# Altium schematic sheet host_connector.SchDoc: WULPUS PRO
size A4; DrawnBy: Sergei Vostrikov; Organization: Integrated Systems Laboratory; Revision: 1.0.0; SheetNumber: 8; SheetTotal: 8
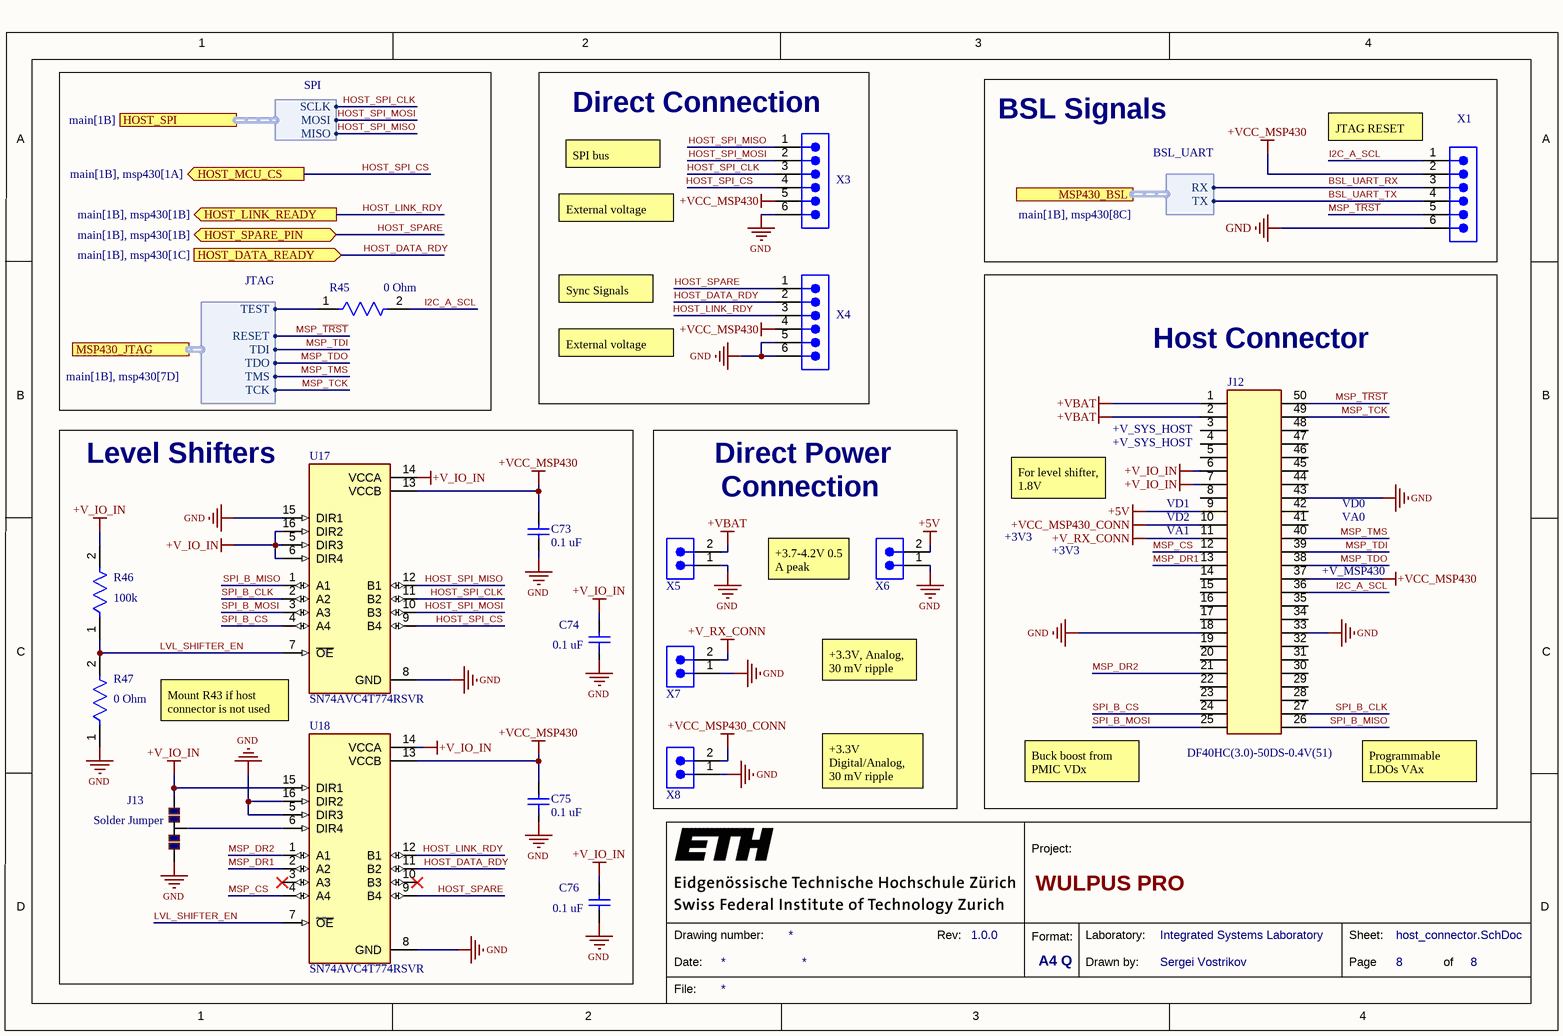
[diagram p0: host_connector.SchDoc]

## Parts
C73  0.1 uF  [CAPC1005X55X30LL05T10]
C74  0.1 uF  [CAPC1005X55X30LL05T10]
C75  0.1 uF  [CAPC1005X55X30LL05T10]
C76  0.1 uF  [CAPC1005X55X30LL05T10]
J12  DF40HC(3.0)-50DS-0.4V(51)  [DF40HC3050DS04V51]
J13  Solder Jumper  [Jumper 3 pins]  (no BOM)
R45  0 Ohm  [FP-CRCW0402-e3-IPC_C]
R46  100k  [FP-ERJ2RK-IPC_C]
R47  0 Ohm  [FP-CRCW0402-e3-IPC_C]
U17  SN74AVC4T774RSVR  [QFN40P260X180X55-16N]
U18  SN74AVC4T774RSVR  [QFN40P260X180X55-16N]
X1  68000-106HLF  [68000-106HLF]  (value not drawn)
X3  68000-106HLF  [68000-106HLF]  (value not drawn)
X4  68000-106HLF  [68000-106HLF]  (value not drawn)
X5  68000-102HLF  [68000-102HLF]  (value not drawn)
X6  68000-102HLF  [68000-102HLF]  (value not drawn)
X7  68000-102HLF  [68000-102HLF]  (value not drawn)
X8  68000-102HLF  [68000-102HLF]  (value not drawn)

## Blocks framed on the sheet
Direct Connection: X3 X4
BSL Signals: X1
Host Connector: J12
Level Shifters: C73-C76 J13 R46 R47 U17 U18

## Ports
HOST_DATA_READY (in, see main[1B], msp430[1C]), HOST_LINK_READY (out, see main[1B], msp430[1B]), HOST_MCU_CS (out, see main[1B], msp430[1A]), HOST_SPARE_PIN (bidir, see main[1B], msp430[1B]), HOST_SPI (harness SPI, see main[1B]), MSP430_BSL (harness BSL_UART, see main[1B], msp430[8C]), MSP430_JTAG (harness JTAG, see main[1B], msp430[7D])

## Harnesses
SPI: SCLK, MOSI, MISO
JTAG: TEST, RESET, TDI, TDO, TMS, TCK
BSL_UART: TX, RX

## Nets
+5V: J12.9 X6.2
+V_IO_IN: C74.1 C76.1 J12.6 J12.7 J13.3 R46.2 U17.5(DIR3) U17.6(DIR4) U17.14(VCCA) U17.16(DIR2) U18.14(VCCA) U18.15(DIR1)
+V_RX_CONN: J12.11 X7.2
+VBAT: J12.1 J12.2 X5.2
+VCC_MSP430: C73.1 C75.1 J12.37 U17.13(VCCB) U18.13(VCCB) X1.2 X3.5 X4.4
+VCC_MSP430_CONN: J12.10 X8.2
GND: C73.2 C74.2 C75.2 C76.2 J12.18 J12.33 J12.43 J13.1 R47.1 U17.8(GND) U17.15(DIR1) U18.5(DIR3) U18.8(GND) U18.16(DIR2) X1.6 X3.6 X4.5 X4.6 X5.1 X6.1 X7.1 X8.1
BSL_UART_RX: X1.3 ; port MSP430_BSL.RX
BSL_UART_TX: X1.4 ; port MSP430_BSL.TX
HOST_DATA_RDY: U18.11(B2) X4.2 ; port HOST_DATA_READY
HOST_LINK_RDY: U18.12(B1) X4.3 ; port HOST_LINK_READY
HOST_SPARE: U18.9(B4) X4.1 ; port HOST_SPARE_PIN
HOST_SPI_CLK: U17.11(B2) X3.3 ; port HOST_SPI.SCLK
HOST_SPI_CS: U17.9(B4) X3.4 ; port HOST_MCU_CS
HOST_SPI_MISO: U17.12(B1) X3.1 ; port HOST_SPI.MISO
HOST_SPI_MOSI: U17.10(B3) X3.2 ; port HOST_SPI.MOSI
I2C_A_SCL: J12.36 R45.2 X1.1
LVL_SHIFTER_EN: R46.1 R47.2 U17.7(~{OE}) U18.7(~{OE})
MSP_CS: J12.12 U18.4(A4)
MSP_DR1: J12.13 U18.2(A2)
MSP_DR2: J12.21 U18.1(A1)
MSP_~{TRST}: J12.50 X1.5 ; port MSP430_JTAG.RESET
MSP_TCK: J12.49 ; port MSP430_JTAG.TCK
MSP_TDI: J12.39 ; port MSP430_JTAG.TDI
MSP_TDO: J12.38 ; port MSP430_JTAG.TDO
MSP_TMS: J12.40 ; port MSP430_JTAG.TMS
SPI_B_CLK: J12.27 U17.2(A2)
SPI_B_CS: J12.24 U17.4(A4)
SPI_B_MISO: J12.26 U17.1(A1)
SPI_B_MOSI: J12.25 U17.3(A3)
NetJ13_2: J13.2 U18.6(DIR4)
NetR45_1: R45.1 ; port MSP430_JTAG.TEST

Not connected (* = marked no-connect by the designer): J12 3 4 5 8 14 15 16 17 19 20 22 23 28 29 30 31 32 34 35 41 42 44 45 46 47 48; U18 3(A3)* 10(B3)*

## Notes on the sheet
- SPI bus
- (near X1) JTAG RESET
- External voltage level
- Sync Signals
- (near J12) +V_SYS_HOST
- Direct Power
- Connection
- For level shifter, 1.8V
- (near J12) VD1
- (near J12) VD2
- VD0
- VA0
- +3.7-4.2V 0.5 A peak
- +3V3
- (near J12) VA1
- (near J12) +V_MSP430
- Mount R43 if host connector is not used
- +3.3V, Analog, 30 mV ripple
- +3.3V Digital/Analog, 30 mV ripple
- Buck boost from PMIC VDx
- Programmable LDOs VAx
- 1
- 2
- 3
- 4
- A
- B
- C
- Project:
- D
- Date:
- Drawing number:
- Rev:
- Format:
- A4 Q
- Drawn by:
- Laboratory:
- Page
- Sheet:
- of
- File:

## Library data of the parts
C73-C76 = CMP-0001-00074-2: C0402C104K4RACTU; Manufacturer: Kemet; Part Number: C0402C104K4RACTU
J12 = DF40HC(3.0)-50DS-0.4V(51): 50 Position 0.4mm Pitch Dual Row Vertical Surface Mount (SMT) Pin Socket, 3.0mm Stacking Height; Mfr_Name: Hirose; Copyright: Copyright (C) 2023 Ultra Librarian. All rights reserved.; Manufacturer_Part_Number: DF40HC(3.0)-50DS-0.4V(51); RefDes: RefDes; Type: DEV
J13 = CMP-00467-6: Solder Jumper 3 Pads; Technology: SMT
R45 R47 = CMP-2002-08122-2: CRCW04020000Z0ED; Tolerance: 5%; Max Power Dissipation: 63mW; Voltage Rating: 50V; Temperature Coefficient: 100ppm/°C; Resistance: 0mR; Contact Plating: Tin; Height: 0.35mm; Radiation Hardening: No; Features: Automotive AEC-Q200; Composition: Thick Film; Width: 0.5mm; Weight: 2.3E-05oz; Termination: SMD/SMT; Packaging: Tape and Reel; Mount: Surface Mount; Case Code (Metric): 1005; Military Standard: Not; Min Operating Temperature: -55°C; Number of Terminations: 2; Package Quantity: 1; Case Code (Imperial): 0402; Depth: 0.5mm; Max Operating Temperature: 155°C; Case/Package: 0402; Power Rating: 63mW; Lead Free: Lead Free; Voltage Rating (DC): 50V; Length: 1mm
R46 = CMP-2002-00608-4: ERJ-2RKF1003X; Resistance: 100kR; Voltage Rating (DC): 50V; Tolerance: 1%; Power Rating: 100mW; Temperature Coefficient: 100ppm/°C; Case/Package: 0402; Length: 1mm; Package Quantity: 1; Radiation Hardening: No; Case Code (Metric): 1005; Contact Plating: Tin; Mount: Surface Mount; Depth: 0.5mm; Max Operating Temperature: 155°C; Lead Free: Lead Free; Width: 0.5mm; Composition: Thick Film; Case Code (Imperial): 0402; Termination: SMD/SMT; Number of Pins: 2; Height: 0.35mm; Voltage Rating: 50V; Military Standard: Not; REACH SVHC: No SVHC; Packaging: Tape and Reel; Min Operating Temperature: -55°C; Max Power Dissipation: 100mW; Features: Automotive AEC-Q200; Number of Terminations: 2
U17 U18 = SN74AVC4T774RSVR: Voltage Level Translator Bidirectional 1 Circuit 4 Channel 380Mbps 16-UQFN _2.6x1.8_; MF: Texas Instruments; MP: SN74AVC4T774RSVR; DigiKey-Purchase-URL: https://snapeda.com/shop?store=DigiKey&id=192411; SnapEDA_Link: https://www.snapeda.com/parts/SN74AVC4T774RSVR/Texas%20Instruments/view-part/192411/?ref=snap; Digi-Key_Part_Number: 296-24741-1-ND; Package: UQFN-16 Texas Instruments; Value: *
X1 X3 X4 = CMP-00729-1: 6 Positions Header, Unshrouded Connector 0.100" (2.54mm) Through Hole Gold or Gold, GXT™; Current Rating: 3A; Voltage Rating: 1.5kV; Number of Positions: 6; Insulation Resistance: 5GR; Gender: Male; Connector Type: Male Pin; Mating Post Length: 5.84mm; Mount: Through Hole; Contact Plating: Nickel, Gold, GXT; Contact Material: Bronze; Colour: Black; Housing Colour: Black; Housing Material: Thermoplastic; Min Operating Temperature: -65°C; Max Operating Temperature: 125°C; Contact Gender: Male; Package Quantity: 100; Number of Rows: 1; Packaging: Bulk; Termination: Solder; Max Voltage Rating (AC): 1.5kV; Number of Contacts: 6; Orientation: Straight; Length: 15.24mm; Pitch: 2.54mm; Termination Post Length: 2.41mm; Contact Mating Length: 0.23inch; Depth: 2.41mm; Radiation Hardening: No; REACH SVHC: No SVHC; Flammability Rating: UL94 V-0
X5-X8 = CMP-00100-3: 2 Positions Header, Unshrouded Connector 0.100" (2.54mm) Through Hole Gold or Gold, GXT™; Manufacturer: Amphenol FCI; Number of Positions: 2; Connector Type: Male Pin; Current Rating: 3A; Gender: Male; Insulation Resistance: 5GR; Mating Post Length: 5.84mm; Max Voltage Rating (AC): 1.5kV; Packaging: Bulk; Supplier: Digikey; Supplier Part Number: 609-3500-ND; ComponentLink1Description: 68000-274228-5149165.pdf; ComponentLink1URL: https://datasheet.ciiva.com/5149/68000-274228-5149165.pdf; Pitch: 2.54mm; Manufacturer Part Number: 68000-102HLF; Number of Rows: 1; Termination: Solder; Contact Mating Length: 0.23inch; Case/Package: 100; Colour: Black; ComponentLink2Description: 68000-722084.pdf; ComponentLink2URL: https://datasheet.ciiva.com/722/68000-722084.pdf; ComponentLink3Description: 68000-10149324.pdf; ComponentLink3URL: https://datasheet.ciiva.com/10149/68000-10149324.pdf; ComponentLink4Description: 68000-16726309.pdf; ComponentLink4URL: https://datasheet.ciiva.com/16726/68000-16726309.pdf; Contact Gender: Male; Contact Material: Bronze; Contact Plating: Nickel,Gold,GXT; Depth: 2.41mm; Flammability Rating: UL94 V-0; Housing Colour: Black; Housing Material: Thermoplastic; Lead Free: Lead Free; Length: 5.08mm; Max Operating Temperature: 125°C; Min Operating Temperature: -65°C; Number of Contacts: 2; Orientation: Straight; Package Quantity: 100; Radiation Hardening: No; Termination Post Length: 2.41mm; Voltage Rating: 1.5kV; Voltage Rating (DC): 1.5kV